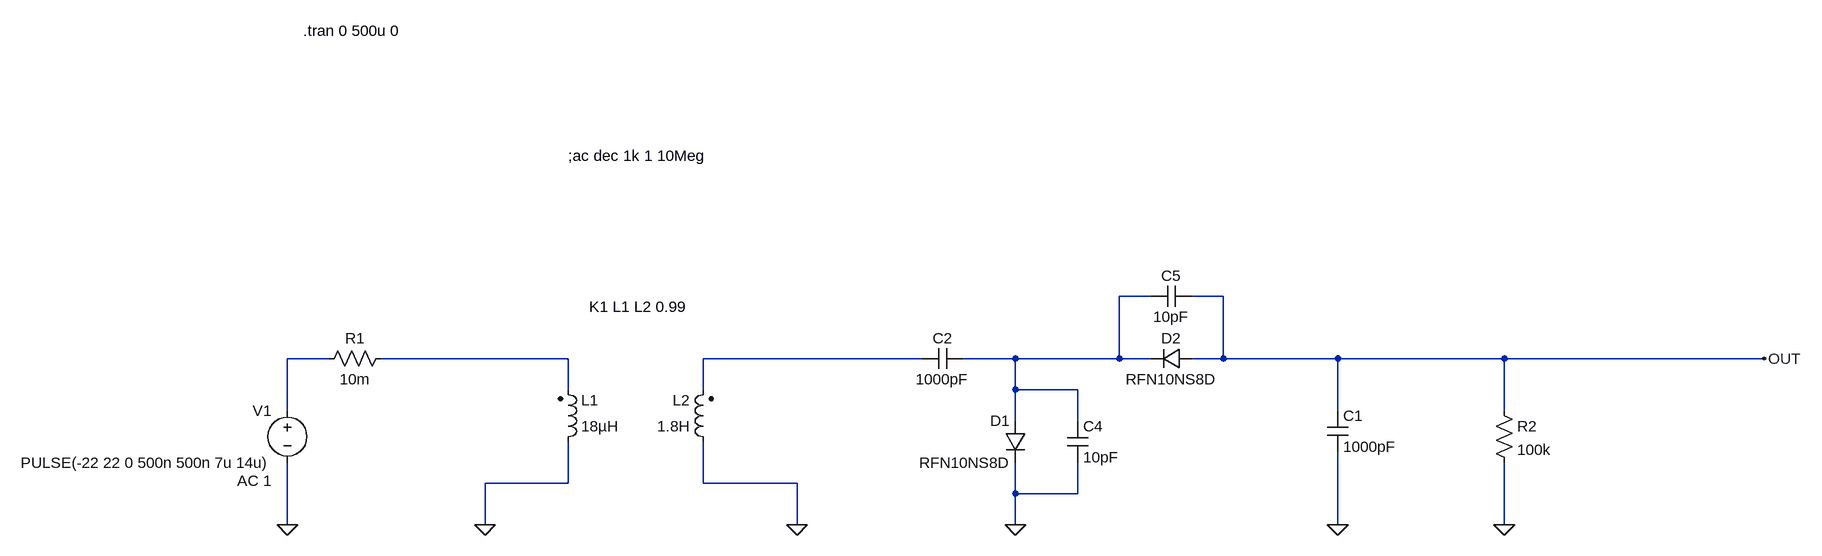
[diagram p0: schematic HV_Transformer.asc]
HV_Transformer.asc, the LTspice schematic file:
Version 4
SHEET 1 2036 680
WIRE 1024 -64 976 -64
WIRE 1136 -64 1088 -64
WIRE -240 32 -304 32
WIRE 128 32 -160 32
WIRE 672 32 336 32
WIRE 816 32 736 32
WIRE 976 32 976 -64
WIRE 976 32 816 32
WIRE 1024 32 976 32
WIRE 1136 32 1136 -64
WIRE 1136 32 1088 32
WIRE 1312 32 1136 32
WIRE 1568 32 1312 32
WIRE 1968 32 1568 32
WIRE 128 80 128 32
WIRE 336 80 336 32
WIRE 816 80 816 32
WIRE 912 80 816 80
WIRE -304 112 -304 32
WIRE 1312 112 1312 32
WIRE 1568 112 1568 32
WIRE 816 128 816 80
WIRE 912 128 912 80
WIRE 128 224 128 160
WIRE 128 224 0 224
WIRE 336 224 336 160
WIRE 480 224 336 224
WIRE 816 240 816 192
WIRE 912 240 912 192
WIRE 912 240 816 240
WIRE -304 288 -304 192
WIRE 0 288 0 224
WIRE 480 288 480 224
WIRE 816 288 816 240
WIRE 1312 288 1312 176
WIRE 1568 288 1568 192
FLAG 0 288 0
FLAG -304 288 0
FLAG 480 288 0
FLAG 1312 288 0
FLAG 816 288 0
FLAG 1968 32 OUT
FLAG 1568 288 0
SYMBOL ind2 112 176 M180
WINDOW 0 36 80 Left 2
WINDOW 3 36 40 Left 2
SYMATTR InstName L1
SYMATTR Value 18µH
SYMATTR Type ind
SYMATTR SpiceLine Rpar=115m
SYMBOL ind2 352 176 R180
WINDOW 0 36 80 Left 2
WINDOW 3 36 40 Left 2
SYMATTR InstName L2
SYMATTR Value 1.8H
SYMATTR Type ind
SYMATTR SpiceLine Rser=155k
SYMBOL voltage -304 96 M0
WINDOW 123 24 124 Left 2
WINDOW 39 0 0 Left 0
SYMATTR InstName V1
SYMATTR Value PULSE(-22 22 0 500n 500n 7u 14u)
SYMATTR Value2 AC 1
SYMBOL cap 1296 112 R0
SYMATTR InstName C1
SYMATTR Value 1000pF
SYMBOL diode 832 128 M0
SYMATTR InstName D1
SYMATTR Value RFN10NS8D
SYMBOL res -256 48 R270
WINDOW 0 32 56 VTop 2
WINDOW 3 0 56 VBottom 2
SYMATTR InstName R1
SYMATTR Value 10m
SYMBOL cap 736 16 R90
WINDOW 0 0 32 VBottom 2
WINDOW 3 32 32 VTop 2
SYMATTR InstName C2
SYMATTR Value 1000pF
SYMBOL res 1552 96 R0
SYMATTR InstName R2
SYMATTR Value 100k
SYMBOL cap 896 128 R0
SYMATTR InstName C4
SYMATTR Value 10pF
SYMBOL diode 1088 16 R90
WINDOW 0 0 32 VBottom 2
WINDOW 3 32 32 VTop 2
SYMATTR InstName D2
SYMATTR Value RFN10NS8D
SYMBOL cap 1088 -48 M270
WINDOW 0 32 32 VTop 2
WINDOW 3 0 32 VBottom 2
SYMATTR InstName C5
SYMATTR Value 10pF
TEXT 160 -48 Left 2 !K1 L1 L2 0.99
TEXT 128 -280 Left 2 !;ac dec 1k 1 10Meg
TEXT -280 -472 Left 2 !.tran 0 500u 0

The netlist it stands for:
* HV_Transformer.asc
L1 0 N003 18µH Rpar=115m
L2 0 N004 1.8H Rser=155k
V1 N002 0 PULSE(-22 22 0 500n 500n 7u 14u) AC 1
C1 OUT 0 1000pF
D1 N001 0 RFN10NS8D
R1 N002 N003 10m
C2 N001 N004 1000pF
R2 OUT 0 100k
C4 N001 0 10pF
D2 OUT N001 RFN10NS8D
C5 OUT N001 10pF
.model D D
.lib standard.dio
K1 L1 L2 0.99
;ac dec 1k 1 10Meg
.tran 0 500u 0
.backanno
.end